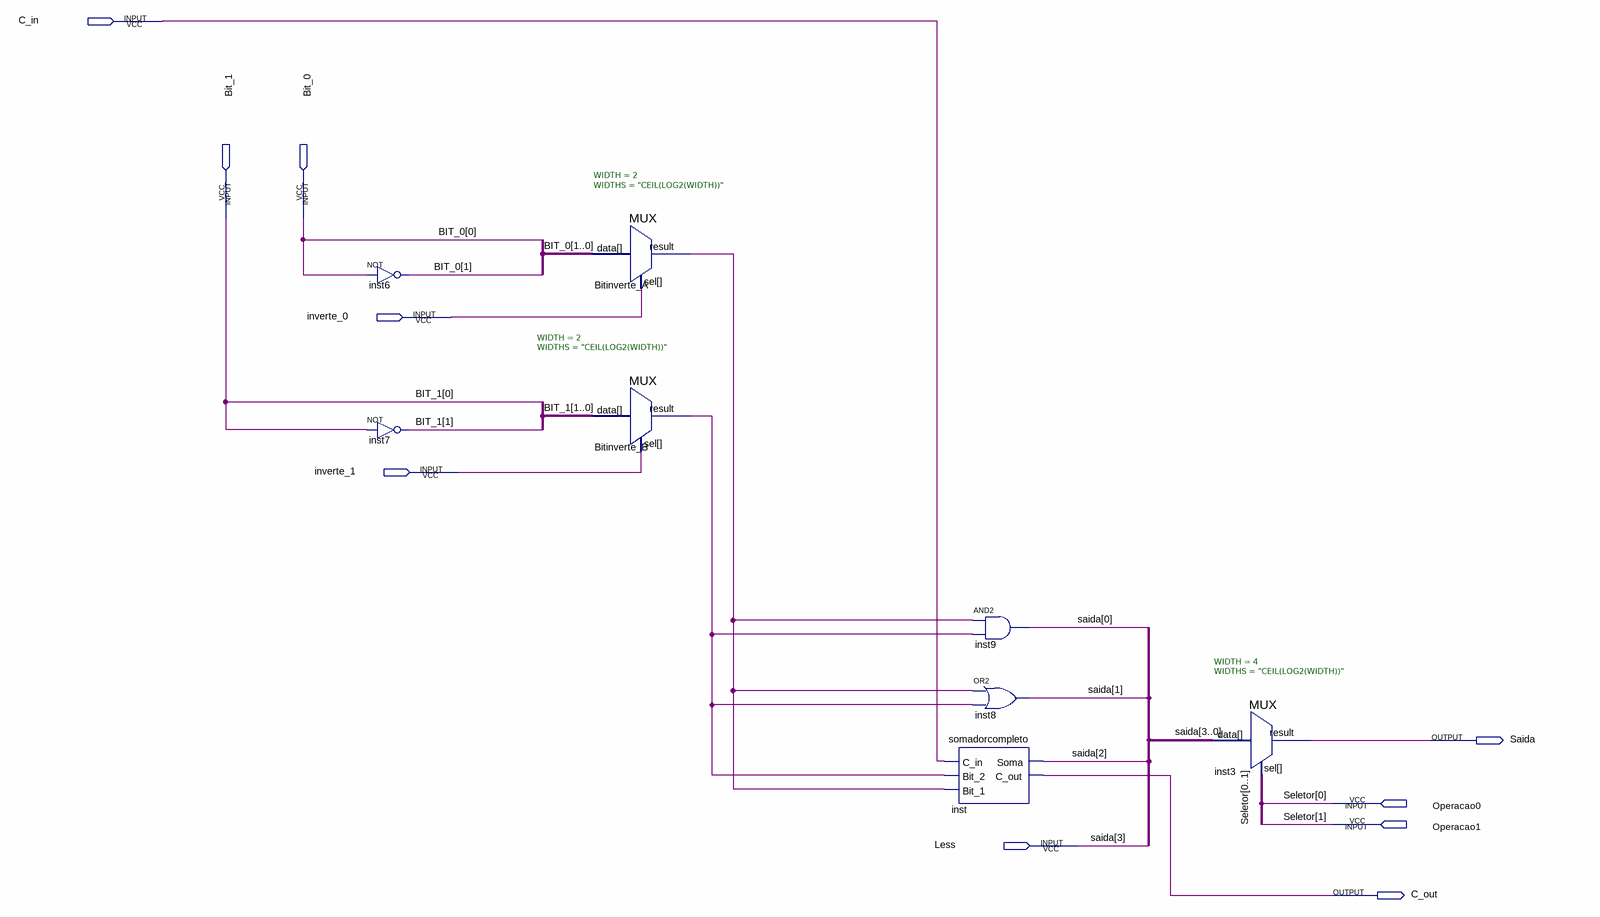
[diagram p0: schematic sheet]
// Quartus schematic ULA.bdf as structural Verilog: 8 symbols, 10 pins
module ULA (
  input  C_in,
  input  Bit_1,
  input  Bit_0,
  input  inverte_0,
  input  inverte_1,
  input  Operacao0,
  input  Operacao1,
  input  Less,
  output Saida,
  output C_out
);

  wire Bitinverte_A_result, Bitinverte_B_result;
  wire [1:1] Bit_0_bus, Bit_1_bus;
  wire [2:0] Saida_bus;

  not inst6 (Bit_0_bus[1], Bit_0);
  not inst7 (Bit_1_bus[1], Bit_1);
  MUX #(.WIDTH(2), .WIDTHS("CEIL(LOG2(WIDTH))")) Bitinverte_A (
    .data({Bit_0_bus[1], Bit_0}), .sel(inverte_0), .result(Bitinverte_A_result));
  MUX #(.WIDTH(2), .WIDTHS("CEIL(LOG2(WIDTH))")) Bitinverte_B (
    .data({Bit_1_bus[1], Bit_1}), .sel(inverte_1), .result(Bitinverte_B_result));
  and inst9 (Saida_bus[0], Bitinverte_A_result, Bitinverte_B_result);
  or inst8 (Saida_bus[1], Bitinverte_A_result, Bitinverte_B_result);
  somadorcompleto inst (
    .C_in(C_in), .Bit_2(Bitinverte_B_result), .Bit_1(Bitinverte_A_result), .Soma(Saida_bus[2]), .C_out(C_out));
  MUX #(.WIDTH(4), .WIDTHS("CEIL(LOG2(WIDTH))")) inst3 (
    .data({Less, Saida_bus}), .sel({Operacao0, Operacao1}), .result(Saida));

  // Other names for the same wires on the sheet: Bit_0[0] = Bit_0; Bit_1[0] = Bit_1; Saida[3] = Less;
  //   Seletor[1:0] = {Operacao1, Operacao0}
endmodule
